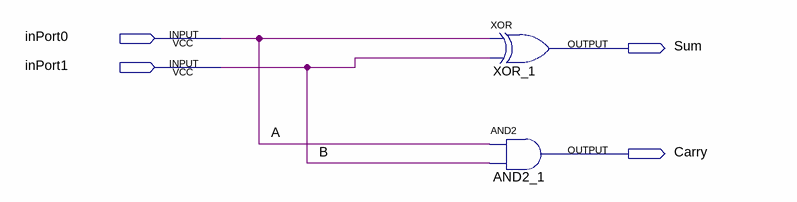
[diagram p0: schematic sheet]
// Quartus schematic Half_Adder.bdf as structural Verilog: 2 symbols, 4 pins
module Half_Adder (
  input  inPort0,
  input  inPort1,
  output Sum,
  output Carry
);

  xor XOR_1 (Sum, inPort0, inPort1);
  and AND2_1 (Carry, inPort0, inPort1);

  // Other names for the same wires on the sheet: A = inPort0; B = inPort1
endmodule
